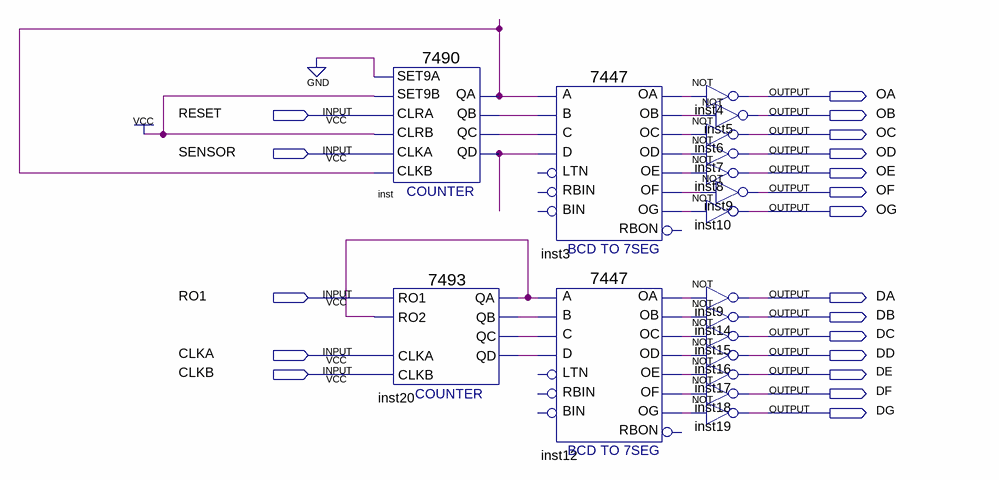
[diagram p0: schematic sheet]
// Quartus schematic prueba2.bdf as structural Verilog: 18 symbols, 19 pins
module prueba2 (
  input  RESET,
  input  SENSOR,
  input  RO1,
  input  CLKA,
  input  CLKB,
  output OA,
  output OB,
  output OC,
  output OD,
  output OE,
  output OF,
  output OG,
  output DA,
  output DB,
  output DC,
  output DD,
  output DE,
  output DF,
  output DG
);

  wire inst3_oa, inst3_ob, inst3_oc, inst3_od, inst3_oe, inst3_of, inst3_og, inst12_oa, inst12_ob, inst12_oc,
       inst12_od, inst12_oe, inst12_of, inst12_og, inst20_qa, inst20_qb, inst20_qc, inst20_qd, inst_qa,
       inst_qb, inst_qc, inst_qd;

  \7490  inst (
    .SET9A(1'b0), .CLRA(RESET), .SET9B(1'b1), .CLKB(inst_qa), .CLKA(SENSOR), .CLRB(1'b1), .QD(inst_qd),
    .QA(inst_qa), .QB(inst_qb), .QC(inst_qc));
  \7493  inst20 (
    .RO1(RO1), .RO2(inst20_qa), .CLKA(CLKA), .CLKB(CLKB), .QC(inst20_qc), .QB(inst20_qb), .QA(inst20_qa),
    .QD(inst20_qd));
  \7447  inst3 (
    .B(inst_qb), .C(inst_qc), .D(inst_qd), .A(inst_qa), .OB(inst3_ob), .OC(inst3_oc), .OE(inst3_oe),
    .OD(inst3_od), .OF(inst3_of), .OG(inst3_og), .OA(inst3_oa));  // open: LTN, RBIN, BIN, RBON
  \7447  inst12 (
    .B(inst20_qb), .C(inst20_qc), .D(inst20_qd), .A(inst20_qa), .OB(inst12_ob), .OC(inst12_oc),
    .OE(inst12_oe), .OD(inst12_od), .OF(inst12_of), .OG(inst12_og), .OA(inst12_oa));  // open: LTN, RBIN, BIN, RBON
  not inst4 (OA, inst3_oa);
  not inst5 (OB, inst3_ob);
  not inst6 (OC, inst3_oc);
  not inst7 (OD, inst3_od);
  not inst8 (OE, inst3_oe);
  not inst9 (OF, inst3_of);
  not inst10 (OG, inst3_og);
  not inst9_dup2 (DA, inst12_oa);
  not inst14 (DB, inst12_ob);
  not inst15 (DC, inst12_oc);
  not inst16 (DD, inst12_od);
  not inst17 (DE, inst12_oe);
  not inst18 (DF, inst12_of);
  not inst19 (DG, inst12_og);
endmodule
